# EAGLE design attiny85_4Transistor (EAGLE 7.2.0)
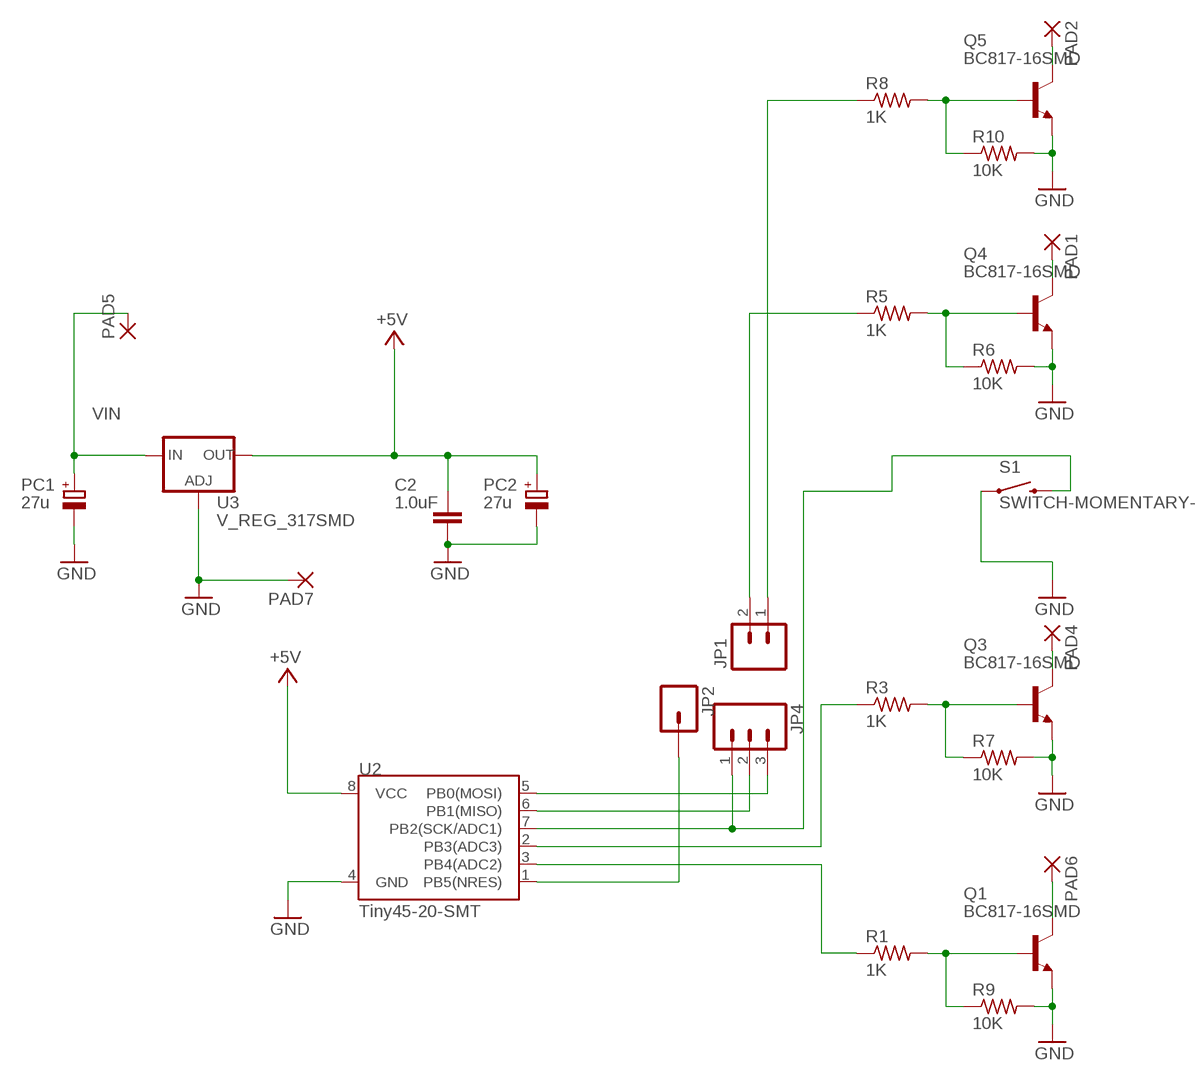
[diagram p0: schematic, sheet 1]

## Parts
C2  1.0uF  1.0UF-25V-+80/-20(0805)  [0805]
JP1  M021X02_NO_SILK  [1X02_NO_SILK]
JP2  M01PTH  [1X01]
JP4  M031X03_NO_SILK  [1X03_NO_SILK]
PAD1  2,15/1,0  [2,15/1,0]
PAD2  2,15/1,0  [2,15/1,0]
PAD4  2,15/1,0  [2,15/1,0]
PAD5  2,15/1,0  [2,15/1,0]
PAD6  2,15/1,0  [2,15/1,0]
PAD7  2,15/1,0  [2,15/1,0]
PC1  27u  CPOL-EUE2.5-5V  [E2,5-4R]
PC2  27u  CPOL-EUE2.5-5V  [E2,5-4R]
Q1  BC817-16SMD  [SOT23-BEC]
Q3  BC817-16SMD  [SOT23-BEC]
Q4  BC817-16SMD  [SOT23-BEC]
Q5  BC817-16SMD  [SOT23-BEC]
R1  1K  R-US_R0805  [R0805]
R3  1K  R-US_R0805  [R0805]
R5  1K  R-US_R0805  [R0805]
R6  10K  R-US_M0805  [M0805]
R7  10K  R-US_M0805  [M0805]
R8  1K  R-US_R0805  [R0805]
R9  10K  R-US_M0805  [M0805]
R10  10K  R-US_M0805  [M0805]
S1  SWITCH-MOMENTARY-2  [TACTILE_FSM4JSMATR]
U2  Tiny45-20-SMT  ATTINY45TINY45-20-SMT  [SO08-EIAJ]
U3  V_REG_317SMD  [SOT223]

## Nets
+5V [usbvcc]: C2.2 PC2.+ U2.8(VCC) U3.2(OUT)
GND: C2.1 PAD7.1(P) PC1.- PC2.- Q1.E Q3.E Q4.E Q5.E R6.2 R7.2 R9.2 R10.2 S1.P$1 S1.P$2 U2.4(GND) U3.1(ADJ)
N$1: Q4.B R5.2 R6.1
N$2: JP4.1 S1.P$3 S1.P$4 U2.7(PB2(SCK/ADC1))
N$4: Q1.B R1.2 R9.1
N$7: Q3.B R3.2 R7.1
N$8: PAD1.1(P) Q4.C
N$9: PAD6.1(P) Q1.C
N$10: JP2.1 U2.1(PB5(NRES))
N$13: PAD4.1(P) Q3.C
N$14: Q5.B R8.2 R10.1
N$19: PAD2.1(P) Q5.C
PWM2: R3.1 U2.2(PB3(ADC3))
PWM3: R1.1 U2.3(PB4(ADC2))
PWM5J: JP1.1 R8.1
PWM5MOSI: JP4.3 U2.5(PB0(MOSI))
PWM6J: JP1.2 R5.1
PWM6MISO: JP4.2 U2.6(PB1(MISO))
VIN [power]: PAD5.1(P) PC1.+ U3.3(IN)

## Library data of the parts
C2 = SparkFun-Capacitors:1.0UF-25V-+80/-20(0805): CAP-11625; PROD_ID: CAP-11625
JP1 = SparkFun-Connectors:M02: Standard 2-pin 0.1" header. Use with - straight break away headers ( PRT-00116) - right angle break away headers (PRT-00553) - swiss pins (PRT-00743) - machine pins (PRT-00117) - female headers (PRT-00115) Molex polarized connector foot print use with: PRT-08233 with associated crimp pins and housings. 2.54_SCREWTERM for use with PRT-10571. 3.5mm Screw Terminal footprints for PRT-08084 5mm Screw Terminal footprints for use with PRT-08432
JP2 = SparkFun-Connectors:M01: Header 1 Standard 1-pin 0.1" header. Use with straight break away headers (SKU : PRT-00116), right angle break away headers (PRT-00553), swiss pins (PRT-00743), machine pins (PRT-00117), and female headers (PRT-00115).
JP4 = SparkFun-Connectors:M03: Header 3 Standard 3-pin 0.1" header. Use with straight break away headers (SKU : PRT-00116), right angle break away headers (PRT-00553), swiss pins (PRT-00743), machine pins (PRT-00117), and female headers (PRT-00115). Molex polarized connector foot print use with SKU : PRT-08232 with associated crimp pins and housings.
PAD1 PAD2 PAD4-PAD7 = wirepad:2,15/1,0: THROUGH-HOLE PAD
PC1 PC2 = rcl:CPOL-EU: POLARIZED CAPACITOR, European symbol
Q1 Q3-Q5 = transistor-npn:BC817*: NPN Transistor
R1 R3 R5 R8 = rcl:R-US_: RESISTOR, American symbol
R6 R7 R9 R10 = adafruit:R-US_: RESISTOR, American symbol
S1 = SparkFun-Electromechanical_alr:SWITCH-MOMENTARY-2: Various NO switches- pushbuttons, reed, etc
U2 = SparkFun-DigitalIC:ATTINY45: Atmel 8-pin 2/4/8kB flash uC; PROD_ID: IC-08922
U3 = SparkFun-PowerIC:V_REG_317: Voltage Regulator Standard LM317 adjustable voltage regulator. AOI (Adjust Output Input). Google 'LM317 Calculator' for easy to use app to get the two resistor values needed. 240/720 for 5V output. 240/390 for 3.3V output. Spark Fun Electronics SKU : COM-00527

## Net classes
1 power: width 0.61 mm, drill 0.61 mm, clearance 0.254 mm
2 gnd: width 0.305 mm, drill 0.559 mm, clearance 0.254 mm
3 usbvcc: width 0.508 mm, drill 0.61 mm, clearance 0.254 mm

## Board
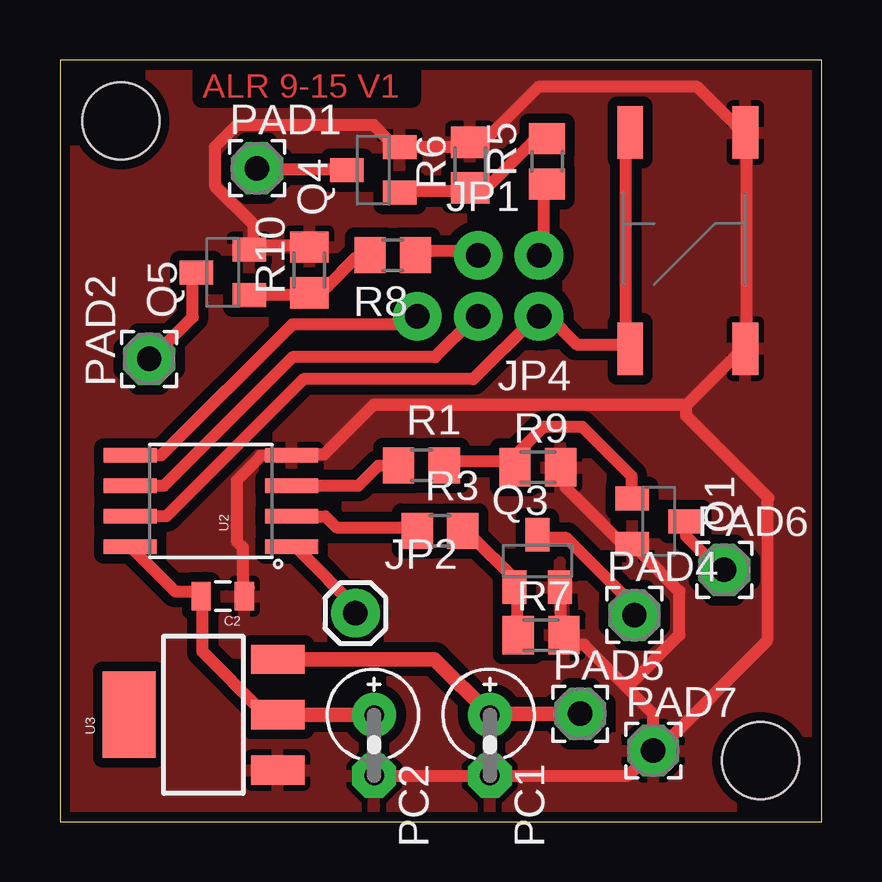
[diagram p1: board, top side]

Size 31.75 x 31.75 mm. Coordinates in mm from the lower left corner, seen from the top.
Outline: 0,0 31.75,0 31.75,31.75 0,31.75 0,0
Copper layers (1*16): Top 0.035mm / dielectric 1.5mm / Bottom 0.035mm
Design rules "SparkFun2 *": minimum track width 20mil, minimum drill 20mil, track to track 16mil, track to pad 16mil, pad to pad 20mil, via to via 20mil, smd to smd 8mil, copper to edge 10mil, drill to drill 8mil, minimum pad ring 20mil, minimum via ring 20mil, stop-mask expansion 5mil, vias tented up to drill 25mil, thermal gap 10mil
Holes 3.2 mm at 2.54,29.21 29.21,2.54
vRestrict: area 5,10.5 to 10.8,15.9

### Footprints (pad centres in the part's own frame; a part is rotated, then mirrored left to right if it is on the bottom)
0805 = smd 0.8 x 1.2: 1 -0.9,0; 2 0.9,0
1X02_NO_SILK = drill 1.016 pad 1.88: 1 0,0; 2 2.54,0
1X01 = drill 1.016 pad 1.88: 1 0,0
1X03_NO_SILK = drill 1.016 pad 1.88: 1 0,0; 2 2.54,0; 3 5.08,0
2,15/1,0 = drill 1.016 pad 2.159 octagon: 1 0,0
E2,5-4R = drill 0.813 pad 1.6: + -1.27,0 | drill 0.813 pad 1.6 octagon: - 1.27,0
SOT23-BEC = smd 1 x 1.4: B -0.95,-1.1; C 0,1.1; E 0.95,-1.1
R0805 = smd 1.3 x 1.5: 1 -0.95,0; 2 0.95,0
M0805 = smd 1.3 x 1.6: 1 -0.95,0; 2 0.95,0
TACTILE_FSM4JSMATR = smd 1.067 x 2.184: P$1 0,0; P$2 0,9.017; P$3 4.801,9.017; P$4 4.801,0
SO08-EIAJ = smd 0.61 x 2.21: 1 -1.905,-3.378; 2 -0.635,-3.378; 3 0.635,-3.378; 4 1.905,-3.378; 5 1.905,3.353; 6 0.635,3.353; 7 -0.635,3.353; 8 -1.905,3.353
SOT223 = smd 1.219 x 2.235: 1 -2.311,-3.099; 2 0,-3.099; 3 2.311,-3.099 | smd 3.6 x 2.2: 4 0,3.099

### Placement (x,y rotation side)
C2  6.79,9.39 180 top
JP1  17.43,23.6 0 top
JP2  12.32,8.69 0 top
JP4  19.97,21.06 180 top
PAD1  8.21,27.24 0 top
PAD2  3.72,19.29 90 top
PAD4  23.95,8.61 0 top
PAD5  21.69,4.49 0 top
PAD6  27.69,10.49 0 top
PAD7  24.73,2.96 0 top
PC1  17.92,3.18 270 top
PC2  13.1,3.18 270 top
Q1  24.96,12.52 270 top
Q3  19.9,10.86 0 top
Q4  13.06,27.16 90 top
Q5  6.79,22.89 90 top
R1  15.07,14.85 0 top
R3  15.84,12.12 0 top
R5  20.3,27.52 90 top
R6  17.1,27.36 90 top
R7  20.06,7.77 0 top
R8  13.88,23.6 180 top
R9  19.92,14.77 0 top
R10  10.4,23 90 top
S1  28.57,28.73 180 top
U2  6.28,13.37 90 top
U3  5.98,4.45 90 top

### Tracks (layer width: path | path; a pad name or v marks a point on that pad's centre or on a via)
+5V
  Top 0.508: 6.04,9.76 C2.2 | C2.2 5.71,9.6 4.8,9.6 2.97,11.43 U2.8 | 8.46,4.57 5.94,7.09 5.94,9.14 C2.2 | 8.91,4.57 8.46,4.57 | U3.2 8.58,4.45 8.46,4.57
  Top 0.61: U3.2 PC2.+
GND
  Top 0.508: 7.87,9.76 C2.1 7.62,9.65 7.62,11.43 7.37,11.68 7.37,14.22 8.38,15.24 9.4,15.24 U2.4 | 9.46,15.24 U2.4 | 9.69,15.24 U2.4 | Q3.E 20.89,9.76 20.89,7.93 R7.2 21.41,7.37 21.84,7.37 23.64,5.58 | Q1.E 23.82,11.66 23.37,11.66 21.08,13.95 21.08,14.63 R9.2 | 24.05,11.43 Q1.E | R10.2 10.34,24 8.05,24 Q5.E 8.05,24.23 8.05,24.92 6.45,26.52 6.45,28.12 7.37,29.03 13.08,29.03 13.99,28.12 Q4.E 14.22,28.12 16.97,28.12 R6.2 17.2,28.35 17.65,28.35 19.94,30.63 26.57,30.63 28.4,28.8 S1.P$1 28.63,28.57 28.63,19.89 S1.P$2 28.4,19.66 26.11,17.37 | 26.11,17.37 13.08,17.37 11.02,15.32 9.88,15.32 U2.4 | 26.11,17.37 26.11,16.92 29.54,13.49 29.49,13.26 29.49,7.54 24.92,2.97 PAD7.1 | PC2.- PC1.- 23.68,1.91 PAD7.1 | PAD7.1 24.73,4.48 23.64,5.58 | 24.23,11.43 Q1.E | 23.64,5.58 25.83,7.77 25.83,9.6 24.23,11.2 Q1.E
  pour Top (isolate 0.406): -0.51,32.77 34.29,32.51 34.29,-2.03 -0.57,-1.36
N$1
  Top 0.508: Q4.B 14.22,26.29 16.97,26.29 R6.1 17.2,26.52 17.88,26.52 19.71,28.35 20.17,28.35 R5.2
N$2
  Top 0.508: 19.98,21.19 JP4.1 | JP4.1 19.75,20.96 17.24,18.44 10.15,18.44 4.44,12.73 U2.7 | 20.21,21.19 JP4.1 | JP4.1 20.4,21.03 21.54,19.89 23.6,19.89 S1.P$3 23.6,20.12 23.6,28.57 S1.P$4
N$4
  Top 0.508: R1.2 16.09,15.01 18.84,15.01 R9.1 18.8,15.09 20.17,16.46 21.77,16.46 23.82,14.4 23.82,13.49 Q1.B
N$7
  Top 0.508: R7.1 19.07,7.93 19.07,9.76 Q3.B 19.07,9.98 17.01,12.04 R3.2
N$8
  Top 0.508: Q4.C 11.94,27.2 8.28,27.2 PAD1.1
N$9
  Top 0.508: Q1.C 26.11,12.34 26.11,11.89 27.48,10.52 PAD6.1
N$10
  Top 0.508: U2.1 9.92,11.36 12.44,8.84 JP2.1
N$13
  Top 0.508: Q3.C 19.98,11.81 21.12,11.81 23.87,9.07 23.87,8.61 PAD4.1
N$14
  Top 0.508: Q5.B 8.05,21.95 10.34,21.95 R10.1 10.57,22.17 11.02,22.17 12.39,23.55 12.85,23.55 R8.2
N$19
  Top 0.508: Q5.C 5.54,22.86 5.54,21.03 3.94,19.43 PAD2.1
PWM2
  Top 0.508: U2.2 9.69,12.73 11.06,12.73 11.52,12.27 14.72,12.27 R3.1
PWM3
  Top 0.508: U2.3 12.44,14 13.28,14.84 14.11,14.84 R1.1
PWM5J
  Top 0.508: R8.1 14.91,23.77 17.42,23.77 JP1.1
PWM5MOSI
  Top 0.508: JP4.3 14.72,20.96 14.49,20.73 9.69,20.73 4.24,15.27 U2.5
PWM6J
  Top 0.508: R5.1 20.17,26.52 20.17,23.77 JP1.2
PWM6MISO
  Top 0.508: JP4.2 17.24,20.96 15.64,19.36 9.69,19.36 4.34,14 U2.6
VIN
  Top 0.61: PAD5.1 21.58,4.5 18.15,4.5 PC1.+ 17.92,4.47 15.62,6.77 U3.3

### Text on the board
Top: ALR 9-15 V1